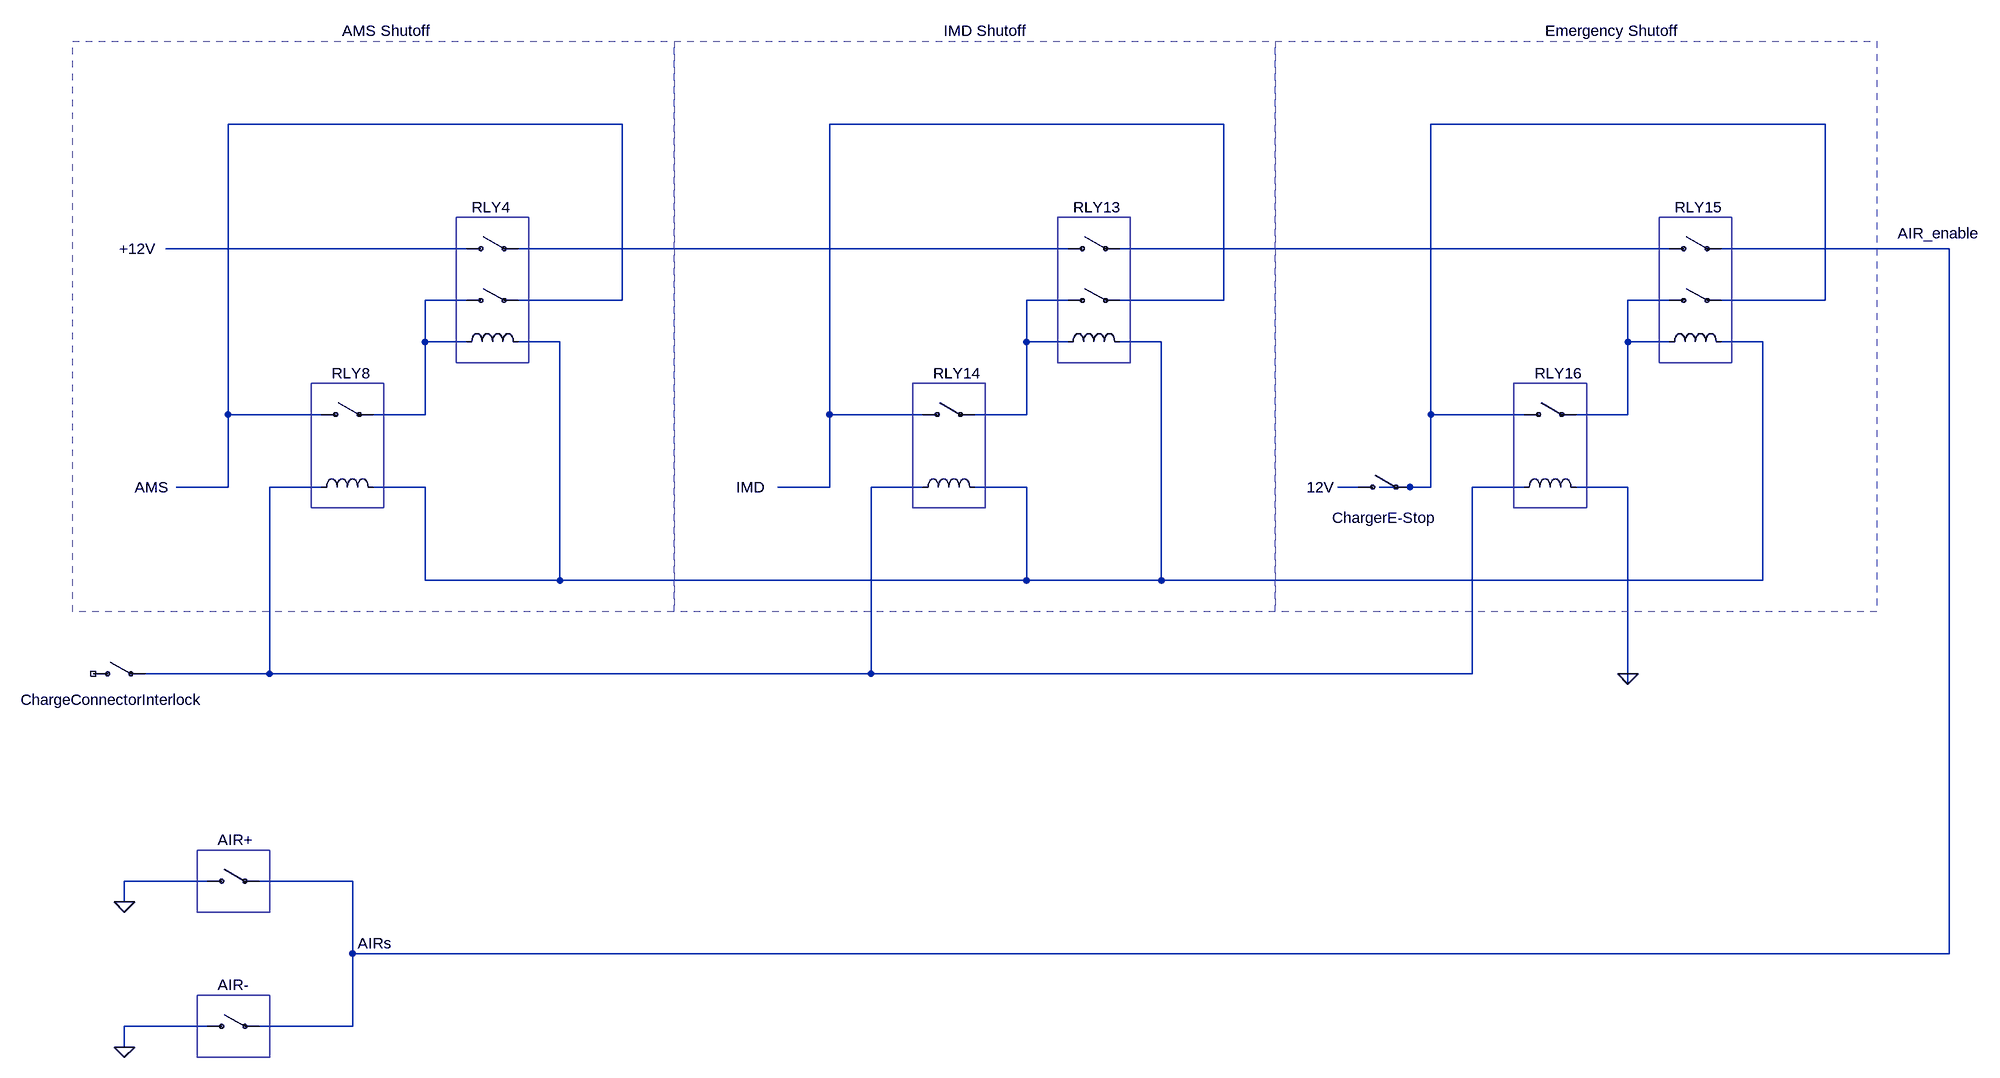
[diagram p0: schematic Charging Shutdown Circuit Schematic RM27.asc]
Charging Shutdown Circuit Schematic RM27.asc, the LTspice schematic file:
Version 4
SHEET 1 3052 1220
WIRE 944 -656 336 -656
WIRE 1872 -656 1264 -656
WIRE 2800 -656 2192 -656
WIRE 704 -464 240 -464
WIRE 1632 -464 784 -464
WIRE 2560 -464 1712 -464
WIRE 2992 -464 2640 -464
WIRE 704 -384 640 -384
WIRE 944 -384 944 -656
WIRE 944 -384 784 -384
WIRE 1632 -384 1568 -384
WIRE 1872 -384 1872 -656
WIRE 1872 -384 1712 -384
WIRE 2560 -384 2496 -384
WIRE 2800 -384 2800 -656
WIRE 2800 -384 2640 -384
WIRE 640 -320 640 -384
WIRE 704 -320 640 -320
WIRE 848 -320 784 -320
WIRE 1568 -320 1568 -384
WIRE 1632 -320 1568 -320
WIRE 1776 -320 1712 -320
WIRE 2496 -320 2496 -384
WIRE 2560 -320 2496 -320
WIRE 2704 -320 2640 -320
WIRE 336 -208 336 -656
WIRE 480 -208 336 -208
WIRE 640 -208 640 -320
WIRE 640 -208 560 -208
WIRE 1264 -208 1264 -656
WIRE 1408 -208 1264 -208
WIRE 1568 -208 1568 -320
WIRE 1568 -208 1488 -208
WIRE 2192 -208 2192 -656
WIRE 2336 -208 2192 -208
WIRE 2496 -208 2496 -320
WIRE 2496 -208 2416 -208
WIRE 336 -96 336 -208
WIRE 336 -96 256 -96
WIRE 480 -96 400 -96
WIRE 640 -96 560 -96
WIRE 1264 -96 1264 -208
WIRE 1264 -96 1184 -96
WIRE 1408 -96 1328 -96
WIRE 1568 -96 1488 -96
WIRE 2080 -96 2048 -96
WIRE 2160 -96 2112 -96
WIRE 2192 -96 2192 -208
WIRE 2192 -96 2160 -96
WIRE 2336 -96 2256 -96
WIRE 2496 -96 2416 -96
WIRE 640 48 640 -96
WIRE 848 48 848 -320
WIRE 848 48 640 48
WIRE 1568 48 1568 -96
WIRE 1568 48 848 48
WIRE 1776 48 1776 -320
WIRE 1776 48 1568 48
WIRE 2704 48 2704 -320
WIRE 2704 48 1776 48
WIRE 400 192 400 -96
WIRE 400 192 208 192
WIRE 1328 192 1328 -96
WIRE 1328 192 400 192
WIRE 2256 192 2256 -96
WIRE 2256 192 1328 192
WIRE 2496 192 2496 -96
WIRE 2496 208 2496 192
WIRE 304 512 176 512
WIRE 528 512 384 512
WIRE 176 544 176 512
WIRE 528 624 528 512
WIRE 2992 624 2992 -464
WIRE 2992 624 528 624
WIRE 304 736 176 736
WIRE 528 736 528 624
WIRE 528 736 384 736
WIRE 176 768 176 736
FLAG 2496 192 0
FLAG 176 544 0
FLAG 176 768 0
SYMBOL csw 128 192 R270
WINDOW 0 104 -124 Invisible 2
WINDOW 3 132 -124 Invisible 2
SYMATTR InstName ChargeConnectorInterlock
SYMATTR Value ChargeConnectorInterlock
SYMBOL ind 688 -304 R270
WINDOW 0 32 56 Invisible 2
WINDOW 3 5 56 Invisible 2
SYMATTR InstName L1
SYMBOL ind 464 -80 R270
WINDOW 0 32 56 Invisible 2
WINDOW 3 5 56 Invisible 2
SYMATTR InstName L2
SYMBOL csw 704 -384 R270
WINDOW 0 32 40 Invisible 2
WINDOW 3 -32 40 Invisible 2
SYMATTR InstName W1
SYMBOL csw 704 -464 R270
WINDOW 0 32 40 Invisible 2
WINDOW 3 -32 40 Invisible 2
SYMATTR InstName W2
SYMBOL csw 480 -208 R270
WINDOW 0 32 40 Invisible 2
WINDOW 3 -32 40 Invisible 2
SYMATTR InstName W3
SYMBOL ind 1616 -304 R270
WINDOW 0 32 56 Invisible 2
WINDOW 3 5 56 Invisible 2
SYMATTR InstName L3
SYMBOL ind 1392 -80 R270
WINDOW 0 32 56 Invisible 2
WINDOW 3 5 56 Invisible 2
SYMATTR InstName L4
SYMBOL csw 1632 -384 R270
WINDOW 0 32 40 Invisible 2
WINDOW 3 -32 40 Invisible 2
SYMATTR InstName W4
SYMBOL csw 1632 -464 R270
WINDOW 0 32 40 Invisible 2
WINDOW 3 -32 40 Invisible 2
SYMATTR InstName W5
SYMBOL csw 1408 -208 R270
WINDOW 0 32 40 Invisible 2
WINDOW 3 -32 40 Invisible 2
SYMATTR InstName W6
SYMBOL ind 2544 -304 R270
WINDOW 0 32 56 Invisible 2
WINDOW 3 5 56 Invisible 2
SYMATTR InstName L5
SYMBOL ind 2320 -80 R270
WINDOW 0 32 56 Invisible 2
WINDOW 3 5 56 Invisible 2
SYMATTR InstName L6
SYMBOL csw 2560 -384 R270
WINDOW 0 32 40 Invisible 2
WINDOW 3 -32 40 Invisible 2
SYMATTR InstName W7
SYMBOL csw 2560 -464 R270
WINDOW 0 32 40 Invisible 2
WINDOW 3 -32 40 Invisible 2
SYMATTR InstName W8
SYMBOL csw 2336 -208 R270
WINDOW 0 32 40 Invisible 2
WINDOW 3 -32 40 Invisible 2
SYMATTR InstName W9
SYMBOL csw 2080 -96 R270
WINDOW 0 32 40 Invisible 2
WINDOW 3 -32 40 VBottom 2
SYMATTR InstName W10
SYMATTR Value ChargerE-Stop
SYMBOL csw 304 512 R270
WINDOW 0 32 40 Invisible 2
WINDOW 3 -32 40 Invisible 2
SYMATTR InstName W13
SYMBOL csw 304 736 R270
WINDOW 0 32 40 Invisible 2
WINDOW 3 -32 40 Invisible 2
SYMATTR InstName W11
TEXT 16 232 Left 2 !ChargeConnectorInterlock
TEXT 712 -528 Left 2 !RLY4
TEXT 192 -96 Left 2 !AMS
TEXT 168 -464 Left 2 !+12V
TEXT 496 -272 Left 2 !RLY8
TEXT 512 -800 Left 2 !AMS Shutoff
TEXT 1640 -528 Left 2 !RLY13
TEXT 1120 -96 Left 2 !IMD
TEXT 1424 -272 Left 2 !RLY14
TEXT 1440 -800 Left 2 !IMD Shutoff
TEXT 2568 -528 Left 2 !RLY15
TEXT 2352 -272 Left 2 !RLY16
TEXT 2368 -800 Left 2 !Emergency Shutoff
TEXT 2912 -488 Left 2 !AIR_enable
TEXT 2000 -96 Left 2 !12V
TEXT 536 608 Left 2 !AIRs
TEXT 320 448 Left 2 !AIR+
TEXT 320 672 Left 2 !AIR-
RECTANGLE Normal 688 -512 800 -288
RECTANGLE Normal 576 -64 464 -256
RECTANGLE Normal 1024 96 96 -784 2
RECTANGLE Normal 1616 -512 1728 -288
RECTANGLE Normal 1504 -64 1392 -256
RECTANGLE Normal 1952 96 1024 -784 2
RECTANGLE Normal 2544 -512 2656 -288
RECTANGLE Normal 2432 -64 2320 -256
RECTANGLE Normal 2880 96 1952 -784 2
RECTANGLE Normal 400 560 288 464
RECTANGLE Normal 400 784 288 688

The netlist it stands for:
* Charging Shutdown Circuit Schematic RM27.asc
W§ChargeConnectorInterlock NC_01 N012 ChargeConnectorInterlock
L1 N008 N011 L
L2 N012 N011 L
W1 N008 N001 CSW
W2 N004 N005 CSW
W3 N001 N008 CSW
L3 N009 N011 L
L4 N012 N011 L
W4 N009 N002 CSW
W5 N005 N006 CSW
W6 N002 N009 CSW
L5 N010 N011 L
L6 N012 0 L
W7 N010 N003 CSW
W8 N006 N007 CSW
W9 N003 N010 CSW
W10 N013 N003 ChargerE-Stop
W13 0 N007 CSW
W11 0 N007 CSW
ChargeConnectorInterlock
RLY4
AMS
+12V
RLY8
AMS Shutoff
RLY13
IMD
RLY14
IMD Shutoff
RLY15
RLY16
Emergency Shutoff
AIR_enable
12V
AIRs
AIR+
AIR-
.backanno
.end